# Altium schematic sheet Sheet2.SchDoc
size A4
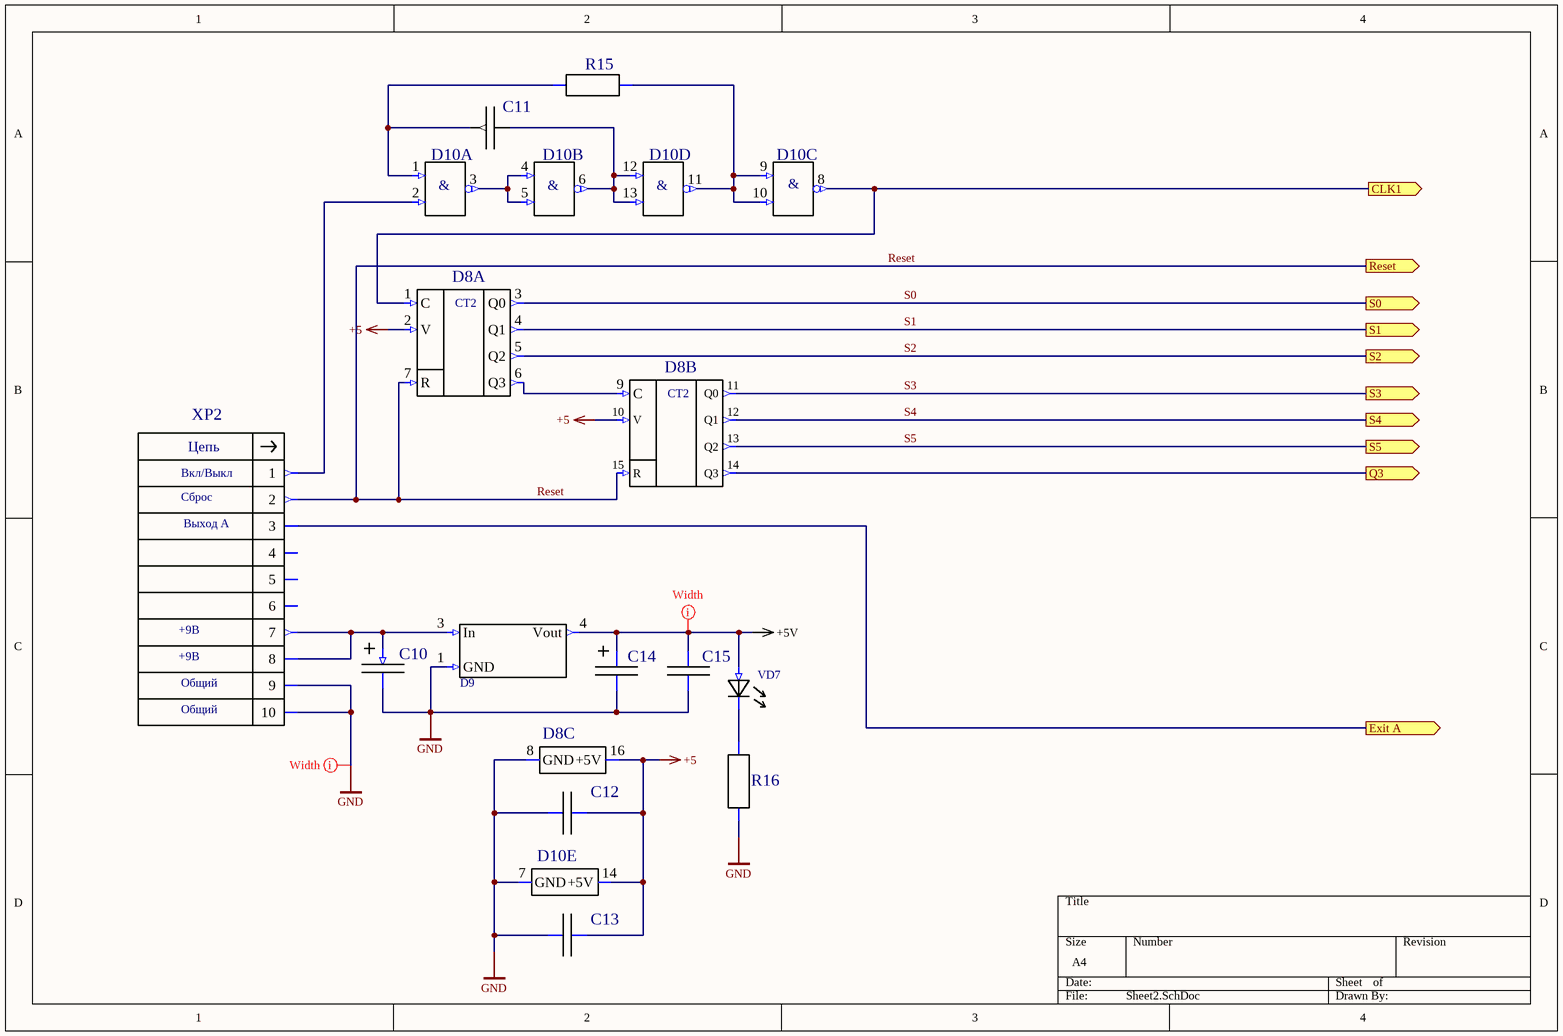
[diagram p0: Sheet2.SchDoc]

## Parts
C10  C  [C-Tantal]  (value not drawn)
C11  1210  [K10-79_3.2_2.5(1210)]  (value not drawn)
C12  (no value)  [0805_N]
C13  (no value)  [0805_N]
C14  C  [C-Tantal]  (value not drawn)
C15  (no value)  [0805_N]
D8  (no value)  [DIP16]  (parts A,B,C of 3)
D9  SOT-223  [LM-1117]  (value not drawn)
D10  74AC00SC  [SO14-N]  (value not drawn)  (parts A,B,C,D,E of 5)
R15  (no value)  [RES_0603_1608_N]
R16  0805  [RES_0805_2012_N]  (value not drawn)
VD7  521-9466  [521-9466]  (value not drawn)
XP2  TE_1-1634689-0  [BH-10R]  (value not drawn)

## Ports
CLK1 (out), Exit A (out), Q3 (out), Reset (out), S0 (out), S1 (out), S2 (out), S3 (out), S4 (out), S5 (out)

## Nets
+5: C12.2 C13.2 D8.2(V) D8.10(V) D8.16(+5V) D10.14(+5V)
+5V: C14.+ C15.2 D9.4(Vout) VD7.A
GND: C10.- C12.1 C13.1 C14.- C15.1 D8.8(GND) D9.1(GND) D10.7(GND) R16.1 XP2.9 XP2.10
CLK1: D8.1(C) D10.8(Out) ; port CLK1
Exit A: XP2.3 ; port Exit A
Q3: D8.14(Q3) ; port Q3
Reset: D8.7(R) D8.15(R) XP2.2 ; port Reset
S0: D8.3(Q0) ; port S0
S1: D8.4(Q1) ; port S1
S2: D8.5(Q2) ; port S2
S3: D8.11(Q0) ; port S3
S4: D8.12(Q1) ; port S4
S5: D8.13(Q2) ; port S5
NetC10_+: C10.+ D9.3(In) XP2.7 XP2.8
NetC11_1: C11.1 D10.1(In1) R15.1
NetC11_2: C11.2 D10.6(Out) D10.12(In1) D10.13(In2)
NetD8_6: D8.6(Q3) D8.9(C)
NetD10_2: D10.2(In2) XP2.1
NetD10_3: D10.3(Out) D10.4(In1) D10.5(In2)
NetD10_9: D10.9(In1) D10.10(In2) D10.11(Out) R15.2
NetR16_2: R16.2 VD7.K

Not connected (* = marked no-connect by the designer): XP2 4 5 6

## Layout directives
mark named Width: +5V, GND

## Notes on the sheet
- Вкл/Выкл
- Сброс
- Выход А
- +9В
- Общий
- (in symbol 74AC00SC, part A) &
- (in symbol 74AC00SC, part B) &
- (in symbol 74AC00SC, part C) &
- (in symbol 74AC00SC, part D) &
- (in symbol MC14520BCP, part A) CT2
- (in symbol MC14520BCP, part B) CT2
- (in symbol TE_1-1634689-0) Цепь

## Library data of the parts
C10 C14 = K53-65_C_10%: К53-65 Конденсатор танталовый C(6032) 0,47-100 мкФ; Manufacturer: ОАО "Элеконд"; Value: 10mc; Voltage: 16; TU: АЖЯР.673546.004 ТУ; Tolerance: 10%; Created_by: Желобаев; BOM: К53-65 "C" - 16B - 10mcмкФ ±10% АЖЯР.673546.004 ТУ; Name2: Конденсатор К53-65; Weight: 0,3; Version: 0; Issue_date: 6.01.2019; Size: C; Name: К53-65; Case: C
C11 = К10-79_1210_Н30: Чип конденсатор 1210 Н30 ряд Е6; Manufacturer: ООО "Кулон"; Name: Конденсатор К10-79; Reliability: 0.000005; Permit MPSU: разрешен; LiveStatus: производится; Packing: катушка; LibraryEngeneer: Желобаев; Tolerance: ±20%; Datum: 19_12_2018; TU: АЖЯР.673511.004 ТУ; Type: K10-79; Hight: 1.75; Voltage: 10; Value: 0.01mc; Value_KD: 0.01 mc F; BOM: Конденсатор К10-79-10-B-0.01 mc F±20%-Н30 АЖЯР.673511.004 ТУ; Version: 00; HelpURL: \\papa\Info\Altium_Library\Даташиты_и_ТУ\Конденсаторы_отечественные\К10-79_АЖЯР_673511_004ТУ.pdf; Weight: 0.2; TKE: Н30; Size: 1210
C12 C13 C15 = К10-79_0805_Н90: Чип конденсатор 0805 Н90 ряд Е6; Manufacturer: ООО "Кулон"; Name: К10-79; Tolerance: +80%-20%; TU: АЖЯР.673511.004 ТУ; Type: K10-79; Voltage: 25; Value: 0.1mc; Value_KD: 0.1 mc F; BOM: К10-79-25-B-0.1 mc F+80%-20%-Н90 АЖЯР.673511.004 ТУ; Created_by: Желобаев; Name2: Конденсатор К10-79; Version: 0; Weight: 0.05; TKE: Н90; Case: 0805; Issue_date: 19_12_2018
D8 = MC14520BCP: Два двоичных счетчика; Manufacturer: Motorola; Created_by: Желобаев; BOM: MC14520BCP "Motorola"; Name2: Микросхема MC14520BCP; Issue_date: 6.01.2019; Version: 0; Name: MC14520BCP; Case: DIP-16
D9 = LM1117DTX-5,0: Преобразователь напряжения 5,0V TO-252; Manufacturer: "Texas Instruments"; Created_by: Шумкин; Name2: Микросхема LM1117DTX-5,0; Name: LM1117DTX-5,0; BOM: =Name+’ ‘+Manufacturer; Case: SOT-223, TO-252, WSON или TO-263
D10 = 74AC00SC: 4 элемента 2И-НЕ TTL SOIC-14; Manufacturer: ON Semiconductor; BOM: 74AC00SC "ON Semiconductor"; Created_by: Желобаев; Power_Voltage: 4.5 - 5.5 V; Name2: Микросхема 74AC00SC; Issue_date: 10.04.2019; Case: SOIC-14; Version: 0; Name: 74AC00SC
R15 = Р1-12-0,1-5%: Резистор от 0,75 Ом до 10 МОм; Manufacturer: ОАО "НПО "Эркон"; Tolerance: 5%; TU: АЛЯР.434110.005 ТУ; Voltage: 50; TKR: M; Value_KD: 7.5 k Om; BOM: Р1-12-0,1 7.5 k Om 5%-M-"A" АЛЯР.434110.005 ТУ; Created_by: Желобаев; Name2: Резистор Р1-12-0,1; Version: 00; Type: Р1-12-0,1±5%-М-"А"; Weight: 0,005; Size: 0603; Name: Р1-12-0,1; Issue_date: 10.04.2019; Case: 0603
R16 = Р1-12-0,125-5%: Резистор от 0,75 Ом до 2 МОм; Manufacturer: ОАО "НПО "Эркон"; Tolerance: 5%; Created_by: Желобаев; TU: АЛЯР.434110.005 ТУ; Voltage: 150; TKR: M; Value_KD: 270 Om; BOM: Р1-12-0,125 270 Om 5%-M-"A" АЛЯР.434110.005 ТУ; Value: 270; Name2: Резистор Р1-12-0,125; Issue_Date: 05_12_2018; Version: 00; Type: Р1-12-0,125±5%-М-"А"; Weight: 0,01; Size: 0805; Name: Р1-12-0,125; Case: 0805
VD7 = 521-9466: Светодиод жёлтый; Manufacturer: “Dialight”; Name2: Светодиод желтый 521-9466; Created_by: Шумкин; Name: 521-9466; Bom: =Name+’ ‘+Manufacturer; Case: Диаметр 5мм вертикальный
XP2 = TE_1-1634689-0: Вилка типа BH-10R угловая правая двухрядная 2х5х2.54; Manufacturer: TE Connectivity; Created_by: Желобаев; BOM: TE_1-1634689-0 "TE Connectivity"; Name2: Вилка угловая TE_1-1634689-0; Name: TE_1-1634689-0; Issue_date: 13.05.2019; Version: 0; Case: BH-10R